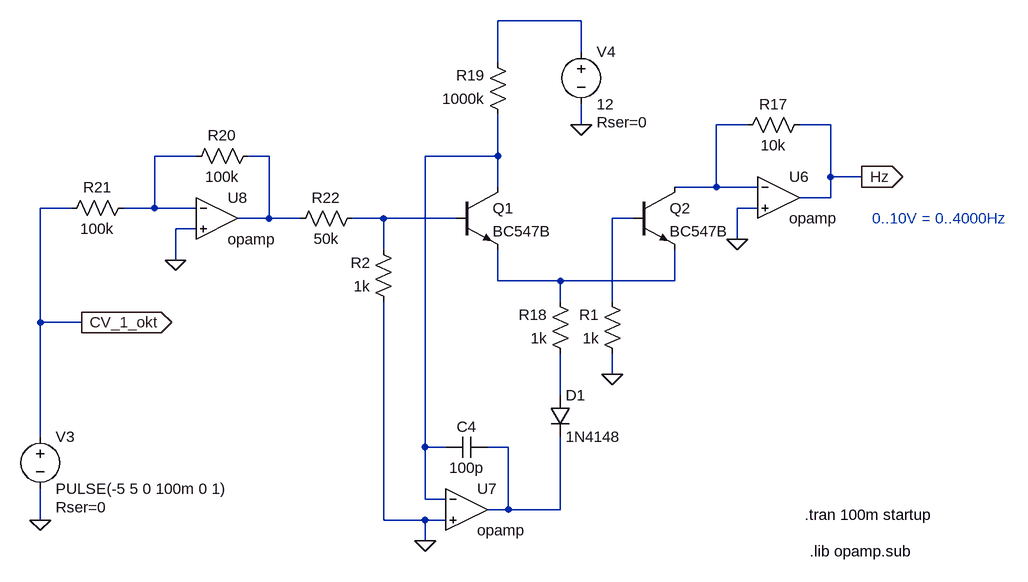
[diagram p0: schematic VCO_exponentiator_2.asc]
VCO_exponentiator_2.asc, the LTspice schematic file:
Version 4
SHEET 1 1212 680
WIRE -1056 -320 -1184 -320
WIRE -1056 -272 -1056 -320
WIRE -1184 -256 -1184 -320
WIRE -1056 -160 -1056 -192
WIRE -800 -160 -848 -160
WIRE -672 -160 -720 -160
WIRE -1648 -112 -1712 -112
WIRE -1536 -112 -1568 -112
WIRE -1184 -112 -1184 -176
WIRE -1184 -112 -1296 -112
WIRE -672 -80 -672 -160
WIRE -624 -80 -672 -80
WIRE -1184 -64 -1184 -112
WIRE -848 -64 -848 -160
WIRE -848 -64 -912 -64
WIRE -784 -64 -848 -64
WIRE -672 -48 -672 -80
WIRE -672 -48 -720 -48
WIRE -1840 -32 -1888 -32
WIRE -1712 -32 -1712 -112
WIRE -1712 -32 -1760 -32
WIRE -1648 -32 -1712 -32
WIRE -784 -32 -816 -32
WIRE -1536 -16 -1536 -112
WIRE -1536 -16 -1584 -16
WIRE -1488 -16 -1536 -16
WIRE -1360 -16 -1408 -16
WIRE -1248 -16 -1360 -16
WIRE -976 -16 -1008 -16
WIRE -1648 0 -1680 0
WIRE -816 16 -816 -32
WIRE -1360 32 -1360 -16
WIRE -1680 48 -1680 0
WIRE -1184 80 -1184 32
WIRE -1088 80 -1184 80
WIRE -912 80 -912 32
WIRE -912 80 -1088 80
WIRE -1088 112 -1088 80
WIRE -1008 112 -1008 -16
WIRE -1888 144 -1888 -32
WIRE -1824 144 -1888 144
WIRE -1008 224 -1008 192
WIRE -1088 256 -1088 192
WIRE -1888 320 -1888 144
WIRE -1296 336 -1296 -112
WIRE -1264 336 -1296 336
WIRE -1168 336 -1200 336
WIRE -1296 416 -1296 336
WIRE -1264 416 -1296 416
WIRE -1168 432 -1168 336
WIRE -1168 432 -1200 432
WIRE -1088 432 -1088 320
WIRE -1088 432 -1168 432
WIRE -1888 448 -1888 400
WIRE -1360 448 -1360 112
WIRE -1296 448 -1360 448
WIRE -1264 448 -1296 448
WIRE -1296 480 -1296 448
FLAG -1888 448 0
FLAG -624 -80 Hz
IOPIN -624 -80 Out
FLAG -816 16 0
FLAG -1296 480 0
FLAG -1056 -160 0
FLAG -1680 48 0
FLAG -1008 224 0
FLAG -1824 144 CV_1_okt
IOPIN -1824 144 Out
SYMBOL voltage -1888 304 R0
WINDOW 123 0 0 Left 0
WINDOW 39 24 124 Left 2
SYMATTR SpiceLine Rser=0
SYMATTR InstName V3
SYMATTR Value PULSE(-5 5 0 100m 0 1)
SYMBOL npn -1248 -64 R0
SYMATTR InstName Q1
SYMATTR Value BC547B
SYMBOL npn -976 -64 R0
SYMATTR InstName Q2
SYMATTR Value BC547B
SYMBOL res -704 -176 R90
WINDOW 0 0 56 VBottom 2
WINDOW 3 32 56 VTop 2
SYMATTR InstName R17
SYMATTR Value 10k
SYMBOL res -1072 208 R180
WINDOW 0 36 76 Left 2
WINDOW 3 36 40 Left 2
SYMATTR InstName R18
SYMATTR Value 1k
SYMBOL Opamps\\opamp -1232 368 R0
SYMATTR InstName U7
SYMBOL voltage -1056 -288 R0
WINDOW 123 0 0 Left 0
WINDOW 39 24 124 Left 2
SYMATTR SpiceLine Rser=0
SYMATTR InstName V4
SYMATTR Value 12
SYMBOL res -1168 -160 R180
WINDOW 0 36 76 Left 2
WINDOW 3 36 40 Left 2
SYMATTR InstName R19
SYMATTR Value 1000k
SYMBOL Opamps\\opamp -1616 -80 R0
SYMATTR InstName U8
SYMBOL res -1552 -128 R90
WINDOW 0 0 56 VBottom 2
WINDOW 3 32 56 VTop 2
SYMATTR InstName R20
SYMATTR Value 100k
SYMBOL res -1744 -48 R90
WINDOW 0 0 56 VBottom 2
WINDOW 3 32 56 VTop 2
SYMATTR InstName R21
SYMATTR Value 100k
SYMBOL cap -1200 320 R90
WINDOW 0 0 32 VBottom 2
WINDOW 3 32 32 VTop 2
SYMATTR InstName C4
SYMATTR Value 100p
SYMBOL res -1392 -32 R90
WINDOW 0 0 56 VBottom 2
WINDOW 3 32 56 VTop 2
SYMATTR InstName R22
SYMATTR Value 50k
SYMBOL Opamps\\opamp -752 -112 R0
SYMATTR InstName U6
SYMBOL res -992 208 R180
WINDOW 0 36 76 Left 2
WINDOW 3 36 40 Left 2
SYMATTR InstName R1
SYMATTR Value 1k
SYMBOL res -1344 128 R180
WINDOW 0 36 76 Left 2
WINDOW 3 36 40 Left 2
SYMATTR InstName R2
SYMATTR Value 1k
SYMBOL diode -1104 256 R0
SYMATTR InstName D1
SYMATTR Value 1N4148
TEXT -712 440 Left 2 !.tran 100m startup
TEXT -608 -16 Left 2 ;0..10V = 0..4000Hz
TEXT -704 496 Left 2 !.lib opamp.sub

The netlist it stands for:
* VCO_exponentiator_2.asc
V3 CV_1_okt 0 PULSE(-5 5 0 100m 0 1) Rser=0
Q1 N005 N006 N008 0 BC547B
Q2 N002 N007 N008 0 BC547B
R17 Hz N002 10k
R18 N009 N008 1k
XU7 N005 0 N010 opamp Aol=100K GBW=10Meg  ; pins invin noninvin out
V4 N001 0 12 Rser=0
R19 N005 N001 1000k
XU8 N003 0 N004 opamp Aol=100K GBW=10Meg  ; pins invin noninvin out
R20 N004 N003 100k
R21 N003 CV_1_okt 100k
C4 N010 N005 100p
R22 N006 N004 50k
XU6 N002 0 Hz opamp Aol=100K GBW=10Meg  ; pins invin noninvin out
R1 0 N007 1k
R2 0 N006 1k
D1 N009 N010 1N4148
.model D D
.lib standard.dio
.model NPN NPN
.model PNP PNP
.lib standard.bjt
.tran 100m startup
* 0..10V = 0..4000Hz
.lib opamp.sub
.backanno
.end